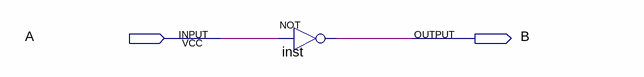
[diagram p0: schematic sheet]
// Quartus schematic MY_NOT.bdf as structural Verilog: 1 symbols, 2 pins
module MY_NOT (
  input  A,
  output B
);

  not inst (B, A);
endmodule
